# Altium schematic sheet Boost.SchDoc
size A4; SheetNumber: 1; SheetTotal: 1
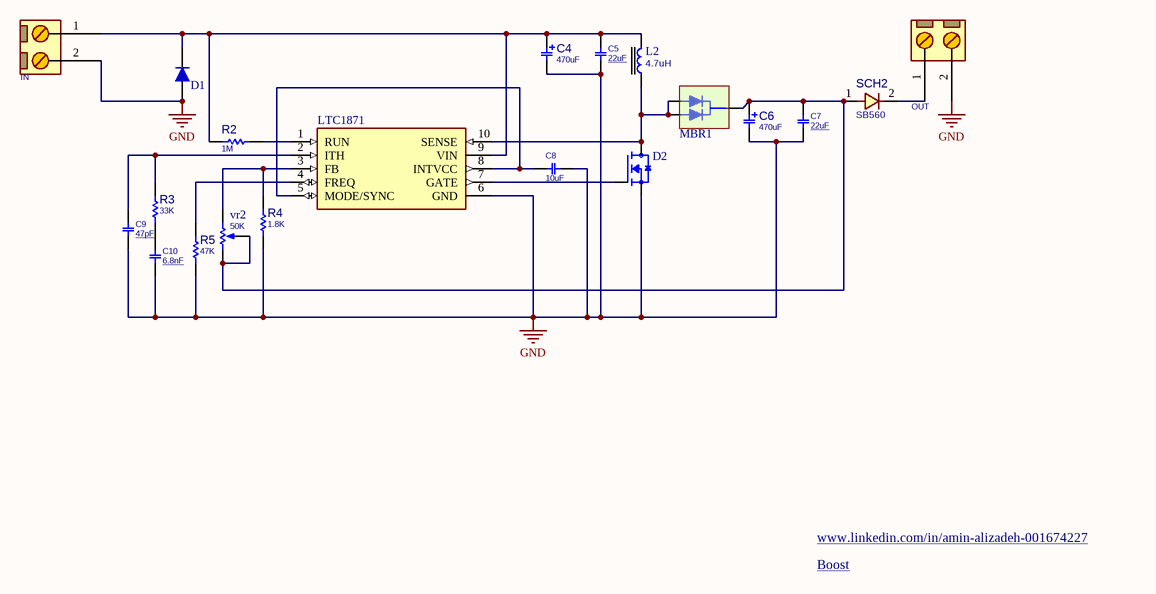
[diagram p0: Boost.SchDoc]

## Parts
C4  470uF  [C_EL_10_10]
C5  22uF  [C1206]
C6  470uF  [C_EL_10_10]
C7  22uF  [C1206]
C8  10uF  [C0805]
C9  47pF  [C0805]
C10  6.8nF  [C0805]
D1  1n4007  [DIOM4629X24N]  (value not drawn)
D2  AOD4184A  [DPAK228P994X240-4N]  (value not drawn)
IN  CONN_TB2  [TBG_2]  (value not drawn)
L2  4.7uH  [L_7]
LTC1871  LTC1871HMS#PBF  [SOP50P490X110-10N]  (value not drawn)
MBR1  MBR20100CT  [TO220]  (value not drawn)
OUT  CONN_TB2  [TBG_2]  (value not drawn)
R2  1M  [R0805]
R3  33K  [R0805]
R4  1.8K  [R0805]
R5  47K  [R0805]
SCH2  SB560  [D_AX07_DO27]
vr2  50K  [POT_3296W]

## Nets
GND: C4.2 C5.1 C6.2 C7.1 C8.2 C9.2 C10.2 D1.1 D2.3(S) IN.2 LTC1871.6(GND) OUT.2 R4.2 R5.2
NetC4_1: C4.1 C5.2 D1.2 IN.1 L2.2 LTC1871.9(VIN) R2.2
NetC6_1: C6.1 C7.2 MBR1.2(K) SCH2.1 vr2.1(TOP) vr2.2(TAP)
NetC8_1: C8.1 LTC1871.5(MODE/SYNC) LTC1871.8(INTVCC)
NetC9_1: C9.1 LTC1871.2(ITH) R3.1
NetC10_1: C10.1 R3.2
NetD2_1: D2.1(G) LTC1871.7(GATE)
NetD2_4: D2.4(D) L2.1 LTC1871.10(SENSE) MBR1.1(A1) MBR1.3(A2)
NetLTC1871_1: LTC1871.1(RUN) R2.1
NetLTC1871_3: LTC1871.3(FB) R4.1 vr2.3(BOT)
NetLTC1871_4: LTC1871.4(FREQ) R5.1
NetOUT_1: OUT.1 SCH2.2

## Notes on the sheet
- www.linkedin.com/in/amin-alizadeh-001674227 <http://www.linkedin.com/in/amin-alizadeh-001674226>
- Boost <http://www.linkedin.com/in/amin-alizadeh-001674226>

## Library data of the parts
C4 C6 = CAP_SMD_EL: CAP, THD, ELEC,; MANF_P#: MANF_PART#; PARAM2: -V; DESC: DESCRIPTION; DIST#: MOUSER; PARAM: 20%; PRICE: 10= -$; MANF: MANF; ASSEMBLY: ASSEMBLY; VALUE: 470uF
C5 C7-C10 = CAP_SMD_MLCC: CAP, MLCC, 1nF, 50V, C0G, 10%, 0402; MANF_P#: MANF_PART#; MANF: Murata; PARAM: C0G, 10%; PRICE: 100= 1$; DESC: CAP, MLCC, 1nF, 50V, C0G, 10%, 0402; PARAM2: 50V; ASSEMBLY: ASSEMBLY
  C5 C7: VALUE: 22uF
  C8: VALUE: 10uF
  C9: VALUE: 47pF
  C10: VALUE: 6.8nF
D1 = 1n4007 SMD M7: Standard Rectifiers; Part. No: M7; Manufacturer: DC COMPONENTS; Designer: Abbas Basereh; Link: http://www.tme.eu/en/details/m7/smd-universal-diodes/dc-components/; Link: https://www.aliexpress.com/item/Smd-tube-1n4007-m7-SMA/1213719741.html?spm=2114.01010208.3.1.ZyZ7bC&ws_ab_test=searchweb0_0,searchweb201602_4_10065_10068_10084_10083_10080_10082_10081_10060_10061_10062_10056_10055_10054_10059_10099_10078_10079_427_10073_10103_10102_10096_10052_10050_10051,searchweb201603_4&btsid=db2be5ca-e560-400a-b91c-484ab5ee228b; Data: 16-12-2016
D2 = AOD4184A: N-Channel 40 V 13A (Ta), 50A (Tc) 2.3W (Ta), 50W (Tc) Surface Mount TO-252 (DPAK); MF: Alpha & Omega Semiconductor Inc.; SnapEDA_Link: https://www.snapeda.com/parts/AOD4184A/Alpha+%2526+Omega+Semiconductor+Inc./view-part/?ref=snap; Package: None; Value: *; MP: AOD4184A; Check_prices: https://www.snapeda.com/parts/AOD4184A/Alpha+%2526+Omega+Semiconductor+Inc./view-part/?ref=eda
IN OUT = CONN_TB2: CONN, TERMINAL BLOCK, 5.08mm pitch; VALUE: CONN_TB2
L2 = INDPWR_SMD: INDUCTOR, POWER, SMD; VALUE: 4.7uH
LTC1871 = LTC1871HMS#PBF: Integrated Circuit; Manufacturer_Name: Analog Devices; Datasheet Link: http://cds.linear.com/docs/en/datasheet/1871fe.pdf; Height: 1.1mm; Manufacturer_Part_Number: LTC1871HMS#PBF; Mouser Part Number: 584-LTC1871HMS#PBF; Mouser Price/Stock: https://www.mouser.co.uk/ProductDetail/Analog-Devices/LTC1871HMSPBF?qs=hVkxg5c3xu%252Bzf5rGR7%2FEaA%3D%3D; Arrow Part Number: LTC1871HMS#PBF; Arrow Price/Stock: https://www.arrow.com/en/products/ltc1871hmspbf/analog-devices?region=europe
MBR1 = MBR20100CT: SCHOTTKY BARRIER 20 AMPERES 80−100 VOLTS
R2-R5 = RES_SMD_0805: RESISTOR, SMD; PARAM: -W; DESC: DESCRIPTION; DIST#: MOUSER; PARAM2: 1%; MANF_P#: -; MANF: -; ASSEMBLY: ASSEMBLY; PRICE: 100= 0.5$
  R2: VALUE: 1M
  R3: VALUE: 33K
  R4: VALUE: 1.8K
  R5: VALUE: 47K
SCH2 = DIODE_THD: DIODE, THD; DESC: DESCRIPTION; PARAM: 100V; PARAM2: 1A; MANF_P#: 1N4001; MANF: MANF; ASSEMBLY: ASSEMBLY; PRICE: PRICE; VALUE: SB560
vr2 = RES_THD_POT_MULTITURN: RESISTOR, THD, Potentiometer Multiturn, most Popular; VALUE: 50K